# EAGLE design ledboard (EAGLE 9.5.1)
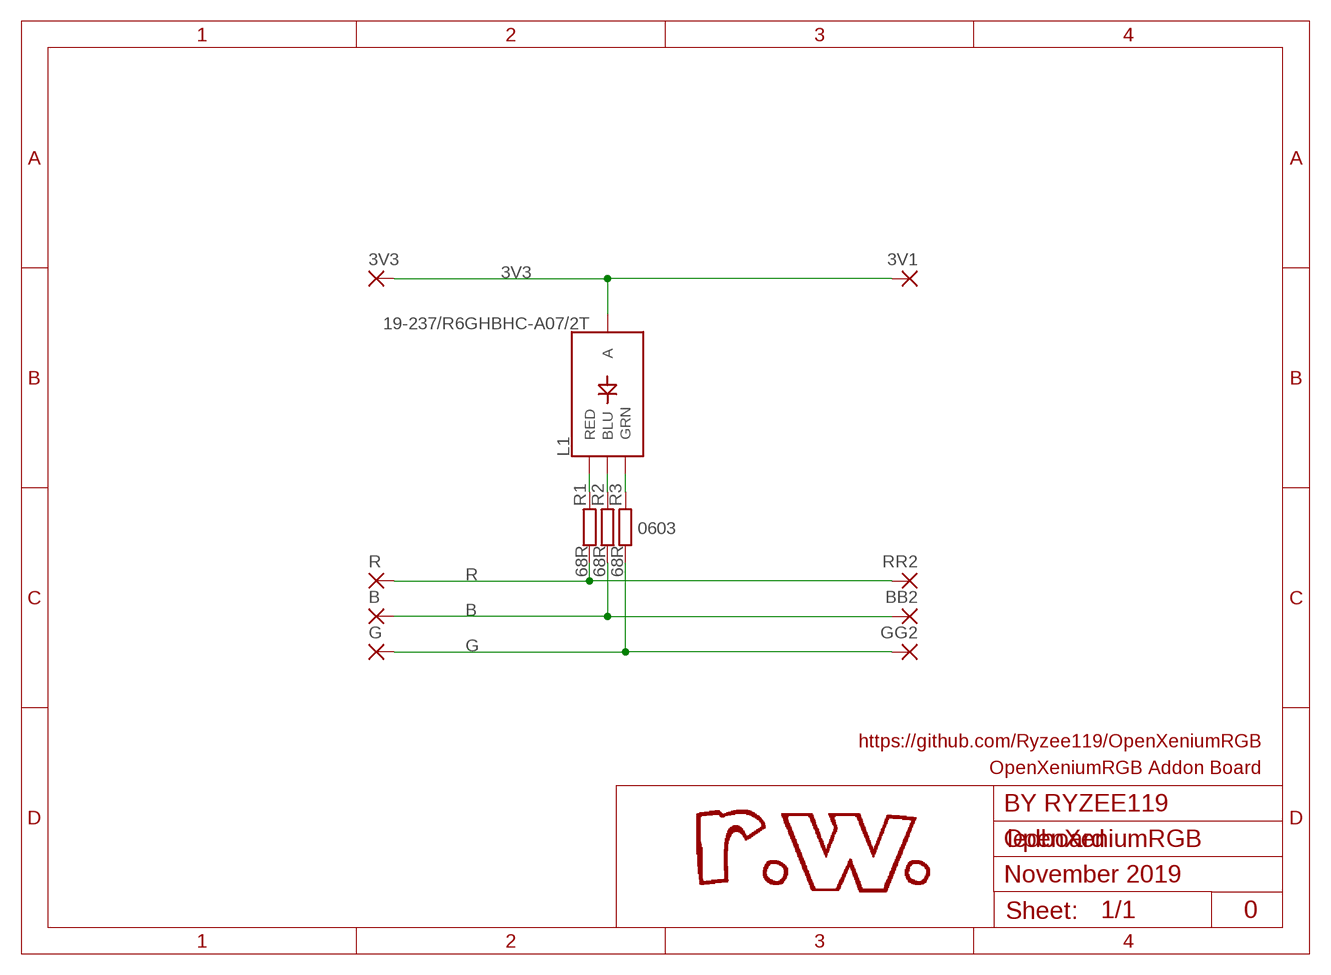
[diagram p0: schematic, sheet 1]

## Parts
3V1  SMD2  [SMD1,27-2,54]
3V3  SMD2  [SMD1,27-2,54]
B  SMD2  [SMD1,27-2,54]
BB2  SMD2  [SMD1,27-2,54]
G  SMD2  [SMD1,27-2,54]
GG2  SMD2  [SMD1,27-2,54]
L1  19-237/R6GHBHC-A07/2T  [4-SMD-R6GHBHC]
R  SMD2  [SMD1,27-2,54]
R1  68R  R-EU_R0603  [R0603]
R2  68R  R-EU_R0603  [R0603]
R3  68R  R-EU_R0603  [R0603]
RR2  SMD2  [SMD1,27-2,54]

## Nets
3V3: 3V1.1(P) 3V3.1(P) L1.P$2(A)
B: B.1(P) BB2.1(P) R2.1
BLUE: L1.P$4(BLU) R2.2
G: G.1(P) GG2.1(P) R3.1
GREEN: L1.P$3(GRN) R3.2
R: R1.1 R.1(P) RR2.1(P)
RED: L1.P$1(RED) R1.2

## Notes on the sheet
- 0603
- https://github.com/Ryzee119/OpenXeniumRGB
- OpenXeniumRGB Addon Board
- BY RYZEE119
- OpenXeniumRGB
- November 2019
- 0

## Library data of the parts
3V1 3V3 B BB2 G GG2 R RR2 = my-library:SMD2: SMD PAD
L1 = my-library:19-237/R6GHBHC-A07/2T
R1-R3 = rcl:R-EU_: RESISTOR, European symbol; SPICEPREFIX: R

## Board
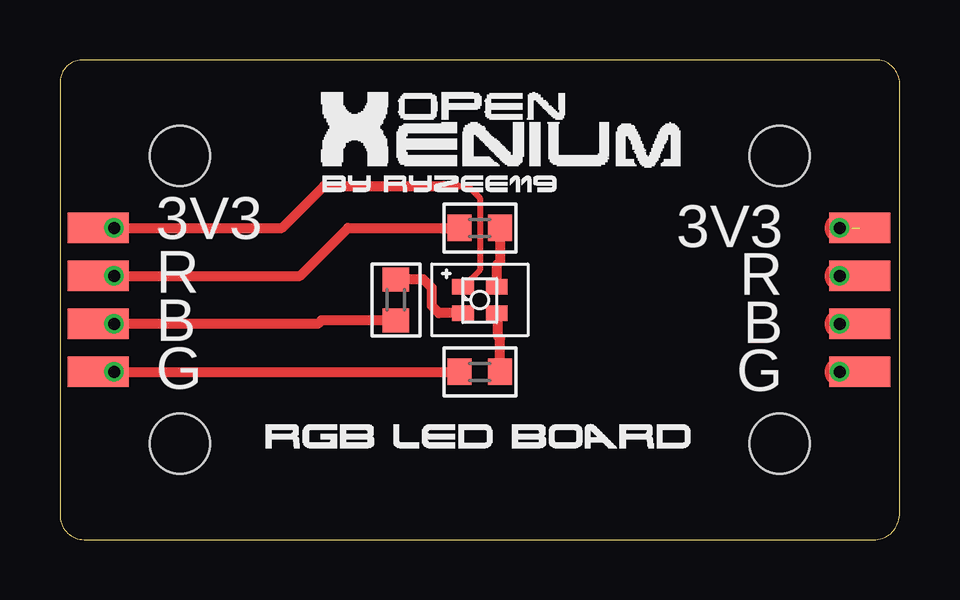
[diagram p1: board, top side]
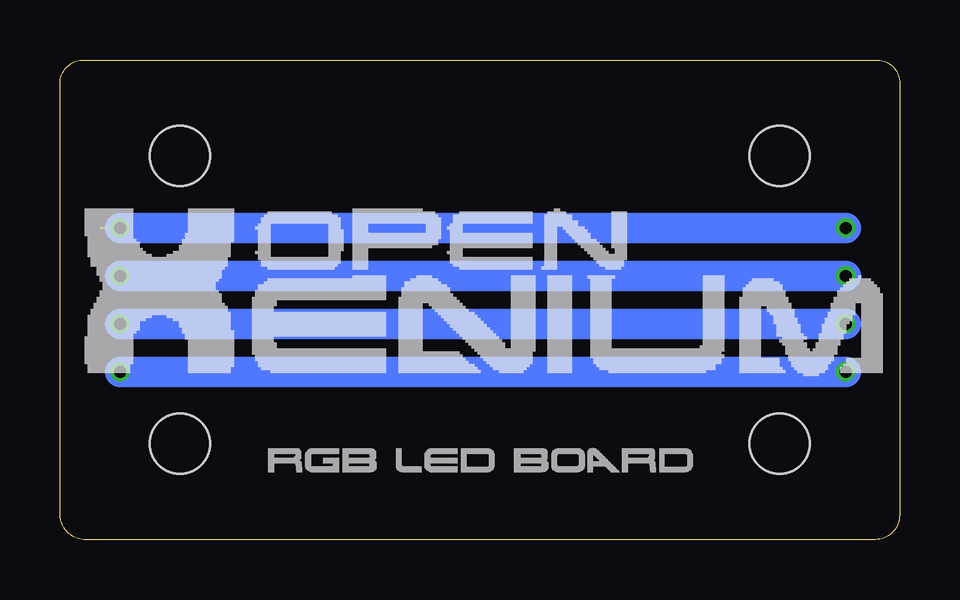
[diagram p2: board, bottom side, seen from below]

Size 35 x 20.01 mm. Coordinates in mm from the lower left corner, seen from the top.
Outline: 0,19.11 0,1.03 arc90 1,0 33.91,0 arc90 35,1.03 35,19.11 arc90 33.91,20 1,20 arc90 0,19.11
Copper layers (1*16): Top 0.035mm / dielectric 1.5mm / Bottom 0.035mm
Design rules "Elecrow_2-layer_eagle_rule": minimum track width 6mil, minimum drill 12mil, track to track 6mil, track to pad 6mil, pad to pad 6mil, via to via 6mil, smd to smd 0mil, copper to edge 10mil, drill to drill 10mil, minimum pad ring 10mil, minimum via ring 6mil, stop-mask expansion 2mil, vias tented up to drill 100mil, thermal gap 10mil
Holes 2.5 mm at 5,16 30,16 5,4 30,4

### Footprints (pad centres in the part's own frame; a part is rotated, then mirrored left to right if it is on the bottom)
SMD1,27-2,54 = smd 1.27 x 2.54: 1 0,0
4-SMD-R6GHBHC = smd 0.9 x 0.65: P$1 -0.7,-0.55; P$2 0.7,-0.55; P$3 -0.7,0.55; P$4 0.7,0.55
R0603 = smd 1 x 1.1: 1 -0.85,0; 2 0.85,0

### Placement (x,y rotation side)
3V1  33.34,13 90 top
3V3  1.59,13 90 top
B  1.59,9 90 top
BB2  33.34,9 90 top
G  1.59,7 90 top
GG2  33.34,7 90 top
L1  17.5,10 180 top
R  1.59,11 90 top
R1  17.5,13 0 top
R2  14,10 90 top
R3  17.5,7 0 top
RR2  33.34,11 90 top

### Tracks (layer width: path | path; a pad name or v marks a point on that pad's centre or on a via)
3V3  (via drill 0.5)  (1 unrouted)
  Top 0.254: 16,14.75 17,14.75 17.5,14.25 17.5,11.25 L1.P$2
  Top 0.406: 3V3.1 9.25,13 11,14.75 16,14.75 16.5,14.75
  Top 1.27: 3V3.1 v2.25,13 | v32.5,13 33,13
  Bottom 1.27: v2.25,13 v32.5,13
B  (via drill 0.5)
  Top 0.406: 1.69,9.39 B.1 10.75,9 10.9,9.15 R2.1
  Top 1.27: B.1 v2.25,9 | v32.5,9 BB2.1
  Bottom 1.27: v2.25,9 v32.5,9
BLUE
  Top 0.406: L1.P$4 15.8,9.45 15.5,9.75 15.5,10.5 15.15,10.85 R2.2
G  (via drill 0.5)
  Top 0.406: G.1 R3.1
  Top 1.27: G.1 v2.25,7 | v32.5,7 GG2.1
  Bottom 1.27: v2.25,7 v32.5,7
GREEN
  Top 0.406: L1.P$3 18.25,9.4 18.25,8.5 18.35,8.4 R3.2
R  (via drill 0.5)
  Top 0.406: R.1 10,11 12,13 R1.1
  Top 1.27: R.1 v2.25,11 | v32.5,11 RR2.1
  Bottom 1.27: v2.25,11 v32.5,11
RED
  Top 0.406: L1.P$1 18.2,11.45 18.35,11.6 R1.2

### Text on the board
tPlace: 3V3 | R | B | G